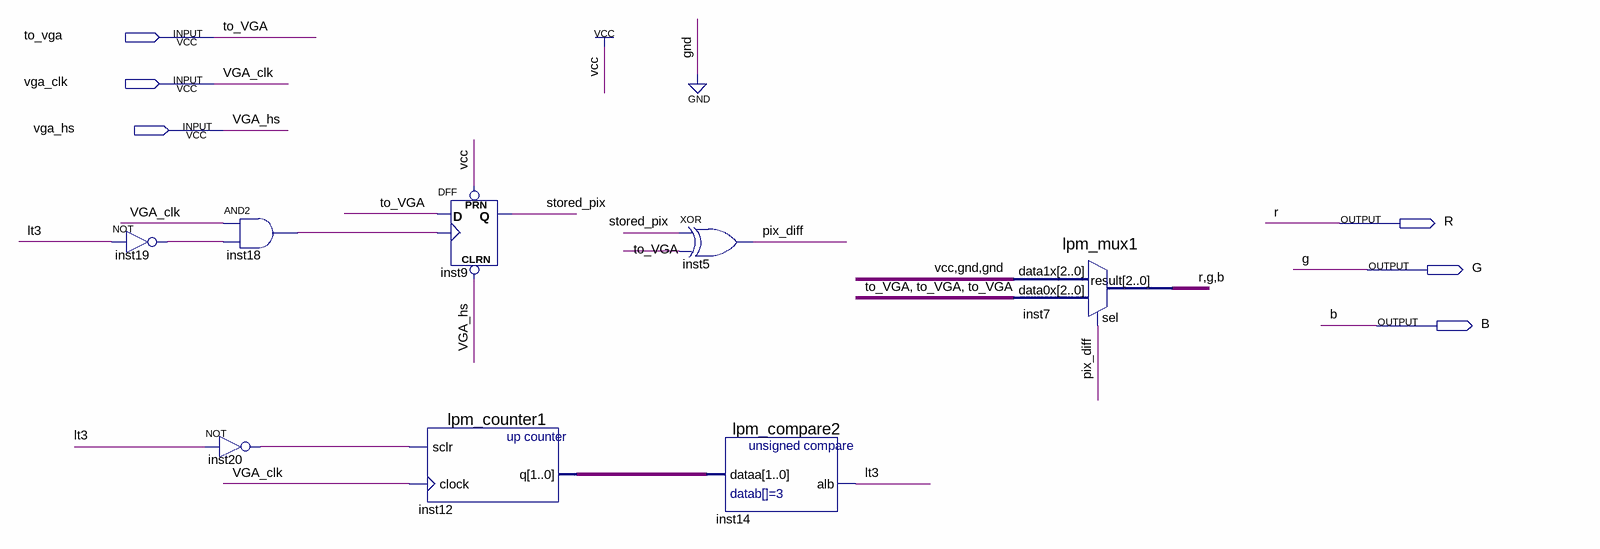
[diagram p0: schematic sheet]
// Quartus schematic red_boundary.bdf as structural Verilog: 8 symbols, 6 pins
module red_boundary (
  input  to_vga,
  input  vga_clk,
  input  vga_hs,
  output R,
  output G,
  output B
);

  wire inst18_out, inst19_out, inst20_out, lt3, pix_diff, stored_pix;
  wire [1:0] inst12_q;

  not inst19 (inst19_out, lt3);
  and inst18 (inst18_out, vga_clk, inst19_out);
  not inst20 (inst20_out, lt3);
  lpm_counter1 inst12 (.sclr(inst20_out), .clock(vga_clk), .q(inst12_q));
  DFF inst9 (.CLRN(vga_hs), .CLK(inst18_out), .D(to_vga), .PRN(1'b1), .Q(stored_pix));
  xor inst5 (pix_diff, stored_pix, to_vga);
  lpm_compare2 inst14 (.dataa(inst12_q), .alb(lt3));
  lpm_mux1 inst7 (.data1x(3'b100), .data0x({3{to_vga}}), .sel(pix_diff), .result({R, G, B}));
endmodule
